# Altium schematic sheet ESP8266_Module.SchDoc
size A; SheetNumber: 6; SheetTotal: 9
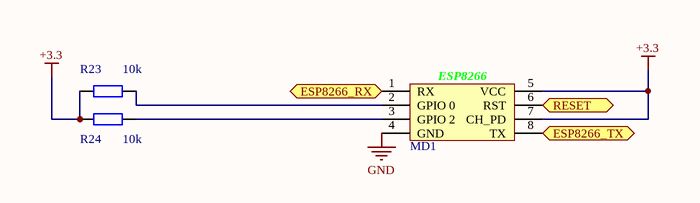
[diagram p0: ESP8266_Module.SchDoc]

## Parts
MD1  ESP8266 Module  [ESP2866 Module]  (value not drawn)
R23  10k  [tro smd 0603]
R24  10k  [tro smd 0603]

## Ports
ESP8266_RX (bidir), ESP8266_TX (bidir), RESET (bidir)

## Nets
+3.3: MD1.5(VCC) MD1.7(CH_PD) R23.1 R24.1
GND: MD1.4(GND)
ESP8266_RX: MD1.1(RX) ; port ESP8266_RX
ESP8266_TX: MD1.8(TX) ; port ESP8266_TX
RESET: MD1.6(RST) ; port RESET
NetMD1_2: MD1.2(GPIO_0) R23.2
NetMD1_3: MD1.3(GPIO_2) R24.2

## Notes on the sheet
- (in symbol ESP8266 Module) ESP8266

## Library data of the parts
R23 R24 = Tro 0603 1% 10k: Dán; Don_Vi: Con; So_Chan: 2; Ten_Linh_Kien: Trở 0603 1% 10k; Ma_Hang: MH006333; Chung_Loai: Dán; Kieu_Chan: *